# EAGLE design USB-Board (EAGLE 7.7.0)
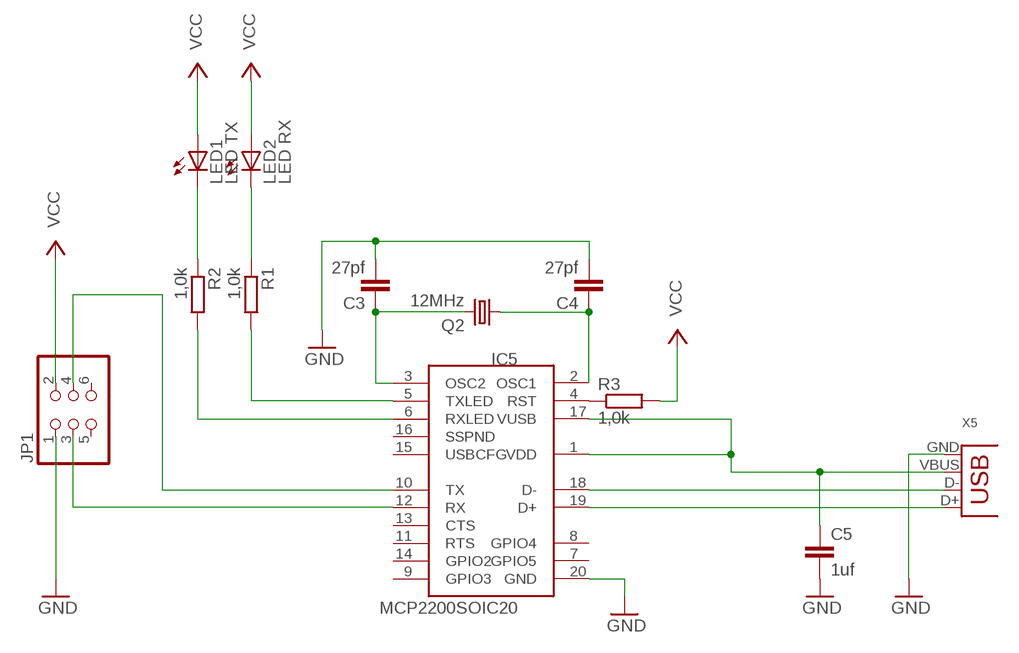
[diagram p0: schematic, sheet 1]

## Parts
C3  27pf  C-EU050-024X044  [C050-024X044]
C4  27pf  C-EU050-024X044  [C050-024X044]
C5  1uf  C5/5.5  [C5B5.5]
IC5  MCP2200SOIC20  [SOIC20]
JP1  PINHD-2X3  [2X03]
LED1  LED TX  LED3MM  [LED3MM]
LED2  LED RX  LED3MM  [LED3MM]
Q2  12MHz  CRYSTALHC18U-V  [HC18U-V]
R1  1,0k  R-EU_0207/10  [0207/10]
R2  1,0k  R-EU_0207/10  [0207/10]
R3  1,0k  R-EU_0207/10  [0207/10]
X5  USB-B-H  [USB-B-H]

## Nets
GND: C3.2 C4.2 C5.2 IC5.20(GND) JP1.1 X5.GND
N$1: LED1.K(C) R2.1
N$2: LED2.K(C) R1.1
N$11: IC5.18(D-) X5.D-
N$13: IC5.19(D+) X5.D+
N$14: IC5.10(TX) JP1.4
N$15: IC5.12(RX) JP1.3
N$17: IC5.4(RST) R3.1
N$18: C3.1 IC5.3(OSC2) Q2.2
N$19: C4.1 IC5.2(OSC1) Q2.1
N$20: IC5.6(RXLED) R2.2
N$21: IC5.5(TXLED) R1.2
N$24: C5.1 IC5.1(VDD) IC5.17(VUSB) X5.VBUS
VCC: JP1.2 LED1.A LED2.A R3.2
Unconnected: IC5.7(GPIO5) IC5.8(GPIO4) IC5.9(GPIO3) IC5.11(RTS) IC5.13(CTS) IC5.14(GPIO2) IC5.15(USBCFG) IC5.16(SSPND) JP1.5 JP1.6

## Library data of the parts
C3 C4 = rcl:C-EU: CAPACITOR, European symbol
C5 = capacitor-wima:C: CAPACITOR naming: grid - package width
IC5 = microchip-update-2:MCP2200: USB 2.0 to UART Protocol Converter with GPIO
JP1 = pinhead:PINHD-2X3: PIN HEADER
LED1 LED2 = led:LED: LED OSRAM: - CHIPLED LG R971, LG N971, LY N971, LG Q971, LY Q971, LO R971, LY R971 LH N974, LH R974 LS Q976, LO Q976, LY Q976 LO Q996 - Hyper CHIPLED LW Q18S LB Q993, LB Q99A, LB R99A - SideLED LS A670, LO A670, LY A670, LG A670, LP A670 LB A673, LV A673, LT A673, LW A673 LH A674 LY A675 LS A676, LA A676, LO A676, LY A676, LW A676 LS A679, LY A679, LG A679 - Hyper Micro SIDELED® LS Y876, LA Y876, LO Y876, LY Y876 LT Y87S - SmartLED LW L88C, LW L88S LB L89C, LB L89S, LG L890 LS L89K, LO L89K, LY L89K LS L896, LA L896, LO L896, LY L896 - TOPLED LS T670, LO T670, LY T670, LG T670, LP T670 LSG T670, LSP T670, LSY T670, LOP T670, LYG T670 LG T671, LOG T671, LSG T671 LB T673, LV T673, LT T673, LW T673 LH T674 LS T676, LA T676, LO T676, LY T676, LB T676, LH T676, LSB T676, LW T676 LB T67C, LV T67C, LT T67C, LS T67K, LO T67K, LY T67K, LW E67C LS E67B, LA E67B, LO E67B, LY E67B, LB E67C, LV E67C, LT E67C LW T67C LS T679, LY T679, LG T679 LS T770, LO T770, LY T770, LG T770, LP T770 LB T773, LV T773, LT T773, LW T773 LH T774 LS E675, LA E675, LY E675, LS T675 LS T776, LA T776, LO T776, LY T776, LB T776 LHGB T686 LT T68C, LB T68C - Hyper Mini TOPLED® LB M676 - Mini TOPLED Santana® LG M470 LS M47K, LO M47K, LY M47K Source: http://www.osram.convergy.de LUXEON: - LUMILED® LXK2-PW12-R00, LXK2-PW12-S00, LXK2-PW14-U00, LXK2-PW14-V00 LXK2-PM12-R00, LXK2-PM12-S00, LXK2-PM14-U00 LXK2-PE12-Q00, LXK2-PE12-R00, LXK2-PE12-S00, LXK2-PE14-T00, LXK2-PE14-U00 LXK2-PB12-K00, LXK2-PB12-L00, LXK2-PB12-M00, LXK2-PB14-N00, LXK2-PB14-P00, LXK2-PB14-Q00 LXK2-PR12-L00, LXK2-PR12-M00, LXK2-PR14-Q00, LXK2-PR14-R00 LXK2-PD12-Q00, LXK2-PD12-R00, LXK2-PD12-S00 LXK2-PH12-R00, LXK2-PH12-S00 LXK2-PL12-P00, LXK2-PL12-Q00, LXK2-PL12-R00 Source: www.luxeon.com KINGBRIGHT: KA-3528ASYC Source: www.kingbright.com
Q2 = crystal:CRYSTAL: CRYSTAL
R1-R3 = resistor:R-EU_: RESISTOR, European symbol
X5 = con-usb-3:USB: USB Connectors

## Board
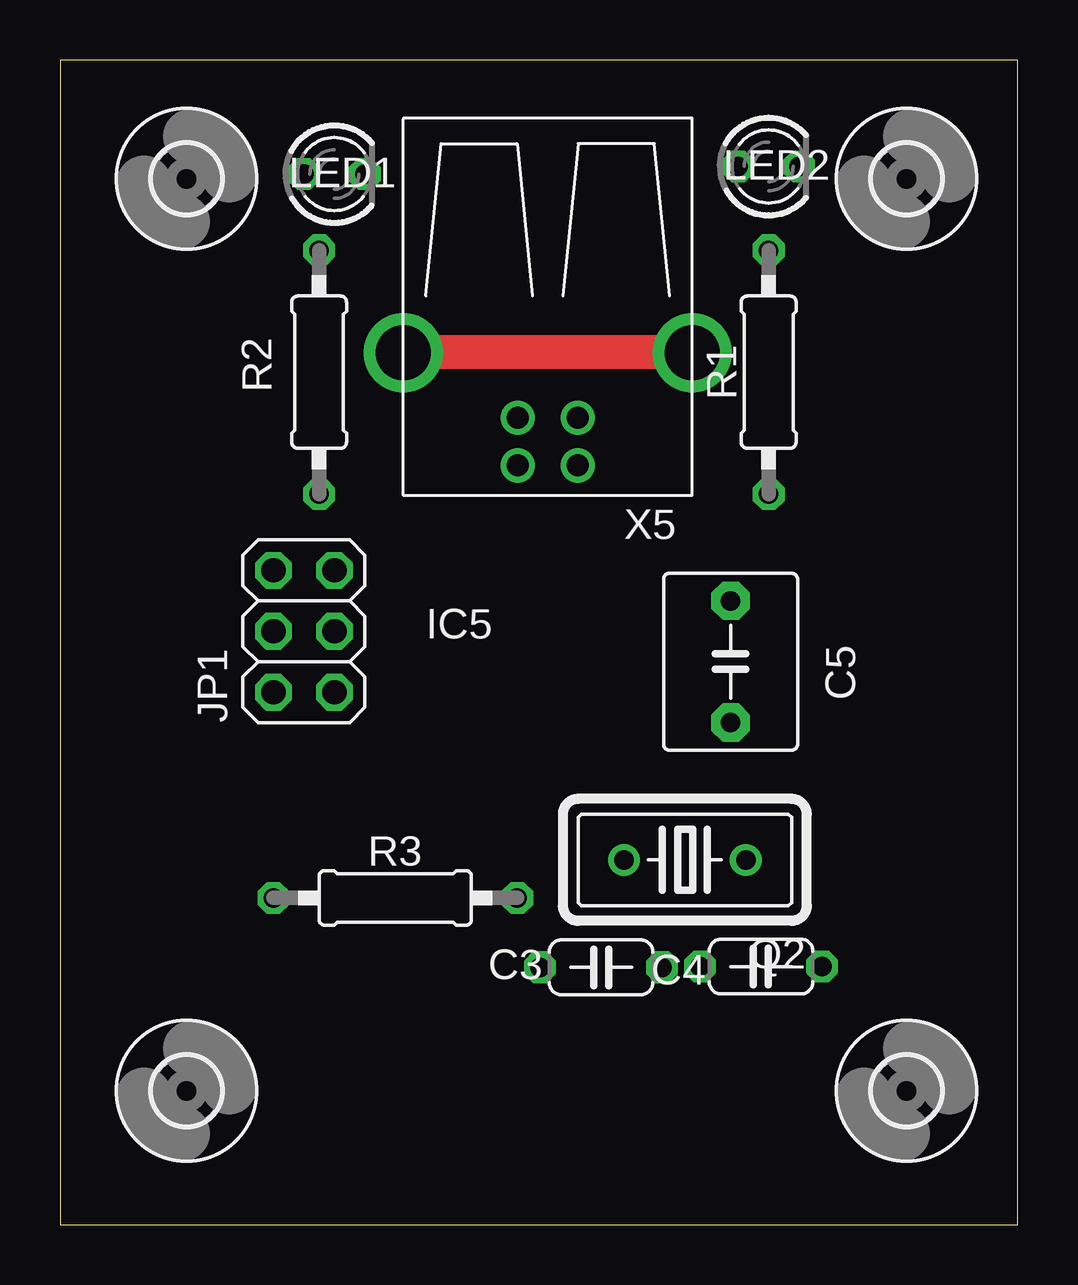
[diagram p1: board, top side]
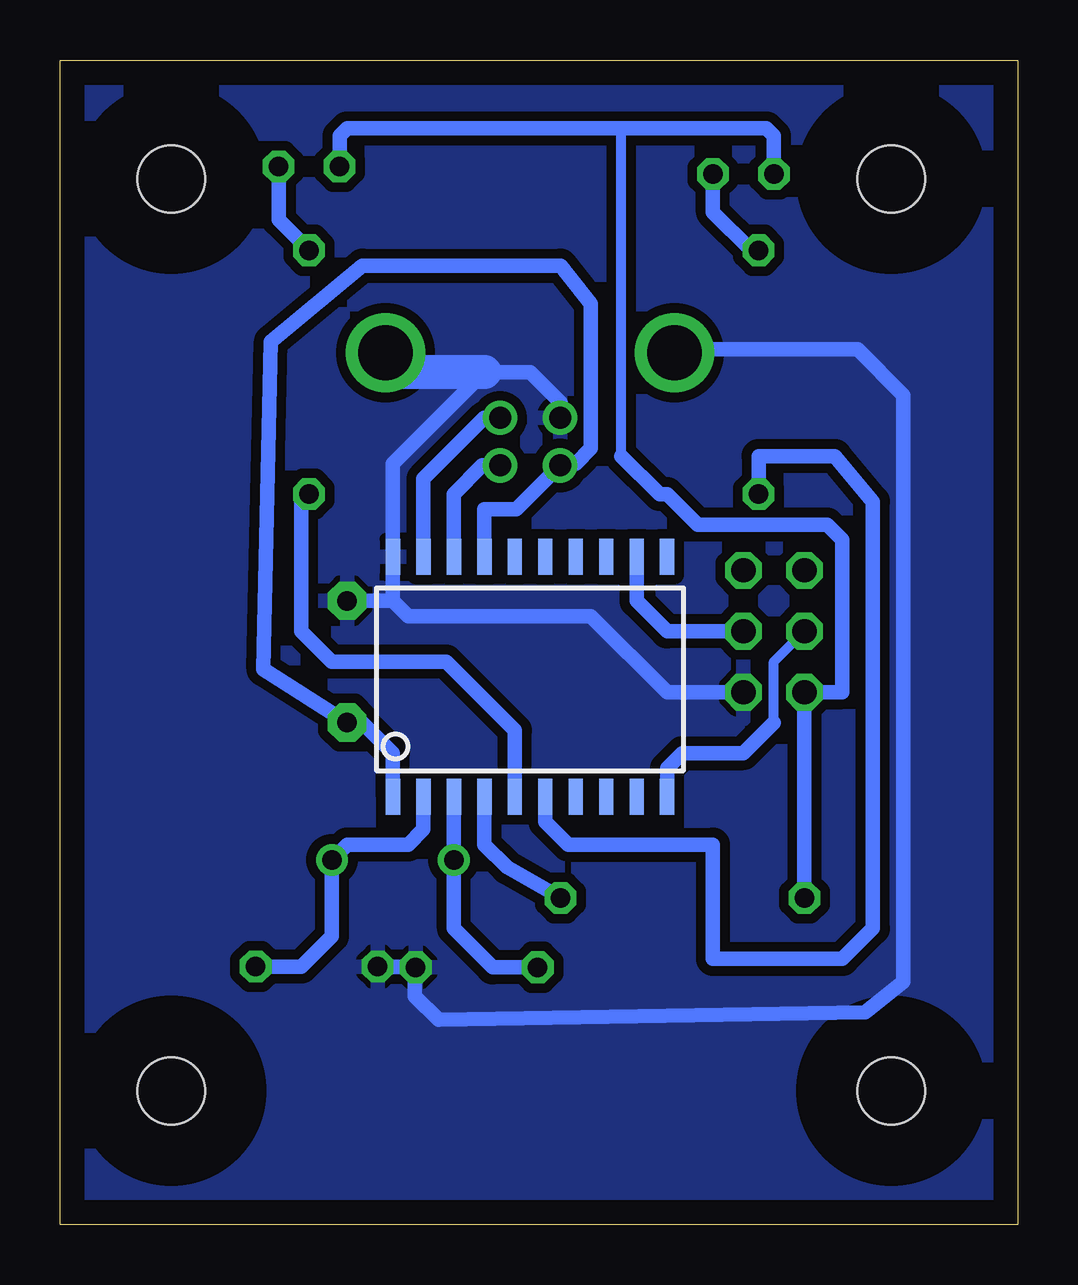
[diagram p2: board, bottom side, seen from below]

Size 39.91 x 48.54 mm. Coordinates in mm from the lower left corner, seen from the top.
Outline: 0,0 39.91,0 39.91,48.54 0,48.54 0,0
Copper layers (1*16): Top 0.035mm / dielectric 1.5mm / Bottom 0.035mm
Design rules "default": minimum track width 10mil, minimum drill 24mil, track to track 8mil, track to pad 8mil, pad to pad 8mil, via to via 8mil, smd to smd 8mil, copper to edge 40mil, drill to drill 8mil, minimum pad ring 10mil, minimum via ring 8mil, stop-mask expansion 4mil, vias tented up to drill 0mil, thermal gap 10mil

### Footprints (pad centres in the part's own frame; a part is rotated, then mirrored left to right if it is on the bottom)
C050-024X044 = drill 0.813 octagon: 1 -2.54,0; 2 2.54,0
C5B5.5 = drill 0.813 pad 1.6 octagon: 1 -2.54,0; 2 2.54,0
SOIC20 = smd 0.6 x 1.5: 1 -5.715,-5; 2 -4.445,-5; 3 -3.175,-5; 4 -1.905,-5; 5 -0.635,-5; 6 0.635,-5; 7 1.905,-5; 8 3.175,-5; 9 4.445,-5; 10 5.715,-5; 11 5.715,5; 12 4.445,5; 13 3.175,5; 14 1.905,5; 15 0.635,5; 16 -0.635,5; 17 -1.905,5; 18 -3.175,5; 19 -4.445,5; 20 -5.715,5
2X03 = drill 1.016 octagon: 1 -2.54,-1.27; 2 -2.54,1.27; 3 0,-1.27; 4 0,1.27; 5 2.54,-1.27; 6 2.54,1.27
LED3MM = drill 0.813 octagon: A -1.27,0; K 1.27,0
HC18U-V = drill 0.813: 1 -2.54,0; 2 2.54,0
0207/10 = drill 0.813 octagon: 1 -5.08,0; 2 5.08,0
2,8 = hole 2.8: 0,0
USB-B-H = drill 0.914: D+ 0,1.25; D- 1.981,1.25; GND 0,-1.25; VBUS 1.981,-1.25 | drill 2.286: P$1 -2.718,-6.02; P$2 -2.718,6.02

### Placement (x,y rotation side)
C3  22.54,10.74 0 top
C4  29.21,10.77 180 top
C5  27.94,23.47 90 top
IC5  20.32,22.83 0 bottom
JP1  10.16,24.74 90 top
LED1  11.43,43.79 0 top
LED2  29.53,44.1 0 top
Q2  26.04,15.21 180 top
R1  29.53,35.53 270 top
R2  10.79,35.53 270 top
R3  13.97,13.62 180 top
U$1  [2,8]  5.27,43.59 0 top
U$2  [2,8]  35.27,43.59 0 top
U$3  [2,8]  5.27,5.59 0 top
U$4  [2,8]  35.27,5.59 0 top
X5  20.32,33.63 270 top

### Tracks (layer width: path | path; a pad name or v marks a point on that pad's centre or on a via)
GND  (via drill 2)
  Top 1.422: v14.32,36.39 26.26,36.39 v26.32,36.33
  Bottom 0.61: X5.GND 19.07,34.24 19.05,34.26 20.32,35.53 22.22,35.53 26.04,31.72 IC5.20 26.04,26.01 | 26.04,26.01 25.4,25.37 17.78,25.37 14.61,22.2 JP1.1 | 26.04,26.01 C5.2 | C4.2 25.11,10.77 | 25.11,10.77 C3.2 | 25.11,10.77 25.11,9.53 24.13,8.55 6.35,8.86 4.76,10.13 4.76,34.58 6.67,36.48 13.97,36.48 14.61,35.85 14.61,36.1 v14.32,36.39
  Bottom 1.422: 22.22,35.53 25.53,35.53 v26.32,36.33
  pour Bottom (isolate 0.406): -0.73,49.09 41.77,49.09 41.77,-1.41 -1.23,-1.41 -1.23,-0.41 -1.73,-0.41 -1.73,49.09
N$1
  Bottom 0.61: R2.1 11.11,40.61 12.7,42.2 LED1.K
N$2
  Bottom 0.61: R1.1 30.8,41.88 LED2.K 30.48,44.1
N$3
  pour Bottom (isolate 0.406): 0.27,48.09 40.27,48.09 40.27,0.59 0.77,0.59 0.77,0.09 0.27,0.09
N$11
  Bottom 0.61: IC5.18 23.5,30.45 22.3,31.65 X5.D-
N$13
  Bottom 0.61: X5.D+ 22.22,33.63 24.77,31.09 IC5.19
N$14
  Bottom 0.406: 10.16,20.93 10.16,23.47 JP1.4
  Bottom 0.61: IC5.10 14.61,19.02 13.97,19.66 11.43,19.66 10.16,20.93
N$15
  Bottom 0.61: JP1.3 14.61,24.74 15.88,26.01 IC5.12
N$17
  Bottom 0.61: IC5.4 22.22,15.85 21.27,14.89 R3.1
N$18
  Bottom 0.61: IC5.3 Q2.2 23.5,12.35 21.88,10.74 C3.1
N$19
  Bottom 0.61: IC5.2 24.77,16.48 25.4,15.85 27.94,15.85 Q2.1 28.57,12.04 29.84,10.77 C4.1
N$20
  Bottom 0.61: IC5.6 19.68,16.8 18.73,15.85 12.7,15.85 12.7,11.09 7.3,11.09 6.03,12.35 6.03,30.13 7.62,32.04 10.79,32.04 R2.2
N$21
  Bottom 0.61: IC5.5 20.95,20.61 23.81,23.47 28.57,23.47 29.84,24.74 29.84,30.13 R1.2
N$24
  Bottom 0.61: IC5.17 22.22,29.82 20.9,29.82 X5.VBUS 18.99,31.72 18.41,31.72 17.78,32.36 17.78,38.39 19.05,39.98 27.3,39.98 31.11,36.8 31.43,23.15 C5.1 27.3,20.93 26.04,19.66 IC5.1
VCC
  Bottom 0.406: 16.51,32.04 16.51,45.69
  Bottom 0.61: R3.2 JP1.2 7.3,22.2 7.3,28.55 7.94,29.18 13.33,29.18 14.61,30.45 14.92,30.45 16.51,32.04 | LED1.A 10.16,45.37 10.48,45.69 16.51,45.69 27.94,45.69 28.26,45.37 LED2.A